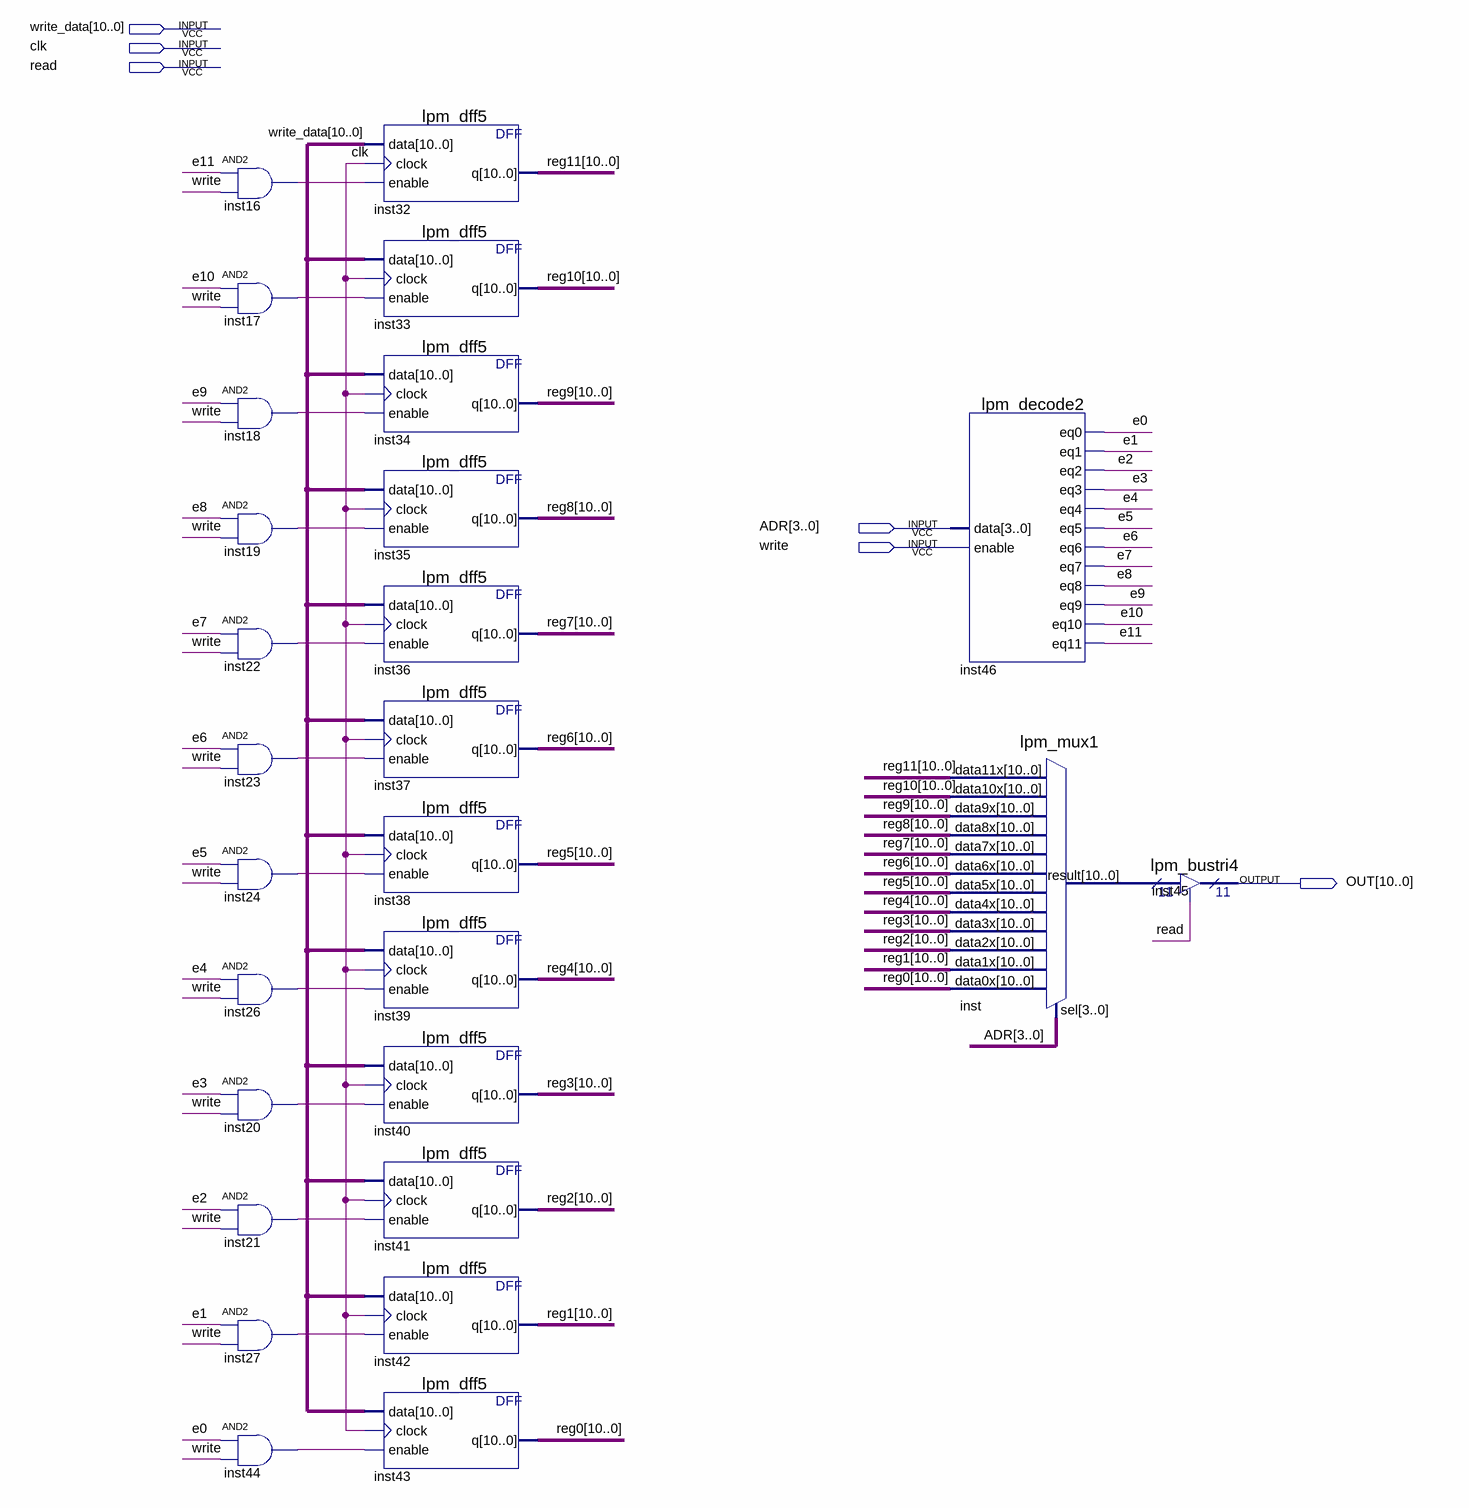
[diagram p0: schematic sheet]
// Quartus schematic POH.bdf as structural Verilog: 27 symbols, 6 pins
module POH (
  input  [10:0] write_data,
  input  clk,
  input  read,
  input  [3:0] ADR,
  input  write,
  output [10:0] OUT
);

  wire e0, e1, e2, e3, e4, e5, e6, e7, e8, e9, e10, e11, inst16_out, inst17_out, inst18_out, inst19_out,
       inst20_out, inst21_out, inst22_out, inst23_out, inst24_out, inst26_out, inst27_out, inst44_out;
  wire [10:0] inst_result, reg0, reg1, reg2, reg3, reg4, reg5, reg6, reg7, reg8, reg9, reg10, reg11;

  and inst16 (inst16_out, e11, write);
  and inst17 (inst17_out, e10, write);
  and inst18 (inst18_out, e9, write);
  and inst19 (inst19_out, e8, write);
  and inst22 (inst22_out, e7, write);
  and inst23 (inst23_out, e6, write);
  and inst24 (inst24_out, e5, write);
  and inst26 (inst26_out, e4, write);
  and inst20 (inst20_out, e3, write);
  and inst21 (inst21_out, e2, write);
  and inst27 (inst27_out, e1, write);
  and inst44 (inst44_out, e0, write);
  lpm_dff5 inst32 (.data(write_data), .clock(clk), .enable(inst16_out), .q(reg11));
  lpm_dff5 inst33 (.data(write_data), .clock(clk), .enable(inst17_out), .q(reg10));
  lpm_dff5 inst34 (.data(write_data), .clock(clk), .enable(inst18_out), .q(reg9));
  lpm_dff5 inst35 (.data(write_data), .clock(clk), .enable(inst19_out), .q(reg8));
  lpm_dff5 inst36 (.data(write_data), .clock(clk), .enable(inst22_out), .q(reg7));
  lpm_dff5 inst37 (.data(write_data), .clock(clk), .enable(inst23_out), .q(reg6));
  lpm_dff5 inst38 (.data(write_data), .clock(clk), .enable(inst24_out), .q(reg5));
  lpm_dff5 inst39 (.data(write_data), .clock(clk), .enable(inst26_out), .q(reg4));
  lpm_dff5 inst40 (.data(write_data), .clock(clk), .enable(inst20_out), .q(reg3));
  lpm_dff5 inst41 (.data(write_data), .clock(clk), .enable(inst21_out), .q(reg2));
  lpm_dff5 inst42 (.data(write_data), .clock(clk), .enable(inst27_out), .q(reg1));
  lpm_dff5 inst43 (.data(write_data), .clock(clk), .enable(inst44_out), .q(reg0));
  lpm_decode2 inst46 (
    .data(ADR), .enable(write), .eq0(e0), .eq1(e1), .eq2(e2), .eq3(e3), .eq4(e4), .eq5(e5), .eq6(e6),
    .eq7(e7), .eq8(e8), .eq9(e9), .eq10(e10), .eq11(e11));
  lpm_mux1 inst (
    .data11x(reg11), .data10x(reg10), .data9x(reg9), .data8x(reg8), .data7x(reg7), .data6x(reg6),
    .data5x(reg5), .data4x(reg4), .data3x(reg3), .data2x(reg2), .data1x(reg1), .data0x(reg0), .sel(ADR),
    .result(inst_result));
  lpm_bustri4 inst45 (.enabledt(read), .data(inst_result), .tridata(OUT));
endmodule
